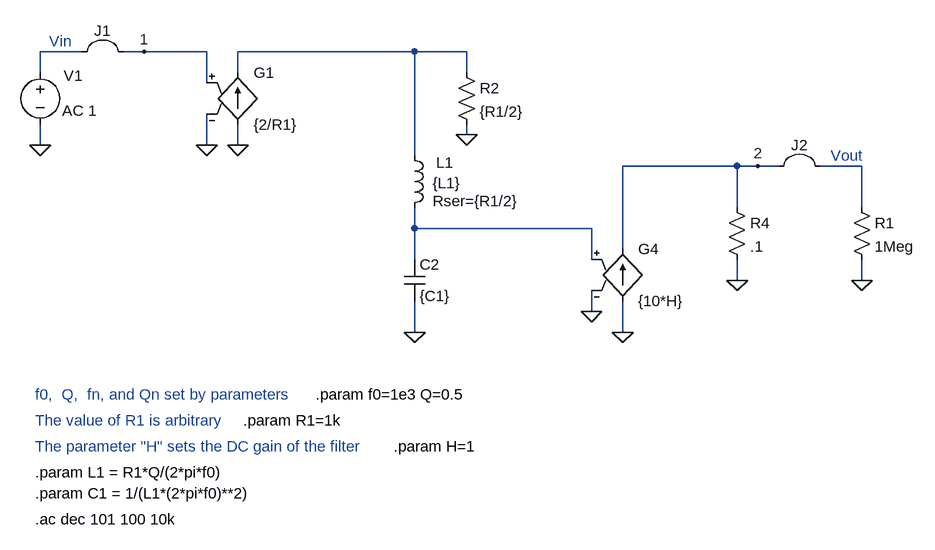
[diagram p0: schematic 2ndOrderLowpass.asc]
2ndOrderLowpass.asc, the LTspice schematic file:
Version 4
SHEET 1 1060 680
WIRE -960 -128 -1024 -128
WIRE -864 -128 -896 -128
WIRE -768 -128 -864 -128
WIRE -448 -128 -720 -128
WIRE -368 -128 -448 -128
WIRE -1024 -96 -1024 -128
WIRE -720 -96 -720 -128
WIRE -368 -96 -368 -128
WIRE -768 -80 -768 -128
WIRE -368 0 -368 -16
WIRE -1024 16 -1024 -16
WIRE -768 16 -768 -32
WIRE -720 16 -720 -16
WIRE -448 32 -448 -128
WIRE 48 48 -128 48
WIRE 80 48 48 48
WIRE 112 48 80 48
WIRE 240 48 176 48
WIRE 48 112 48 48
WIRE 240 112 240 48
WIRE -448 144 -448 112
WIRE -176 144 -448 144
WIRE -128 176 -128 48
WIRE -448 192 -448 144
WIRE -176 192 -176 144
WIRE 48 224 48 192
WIRE 240 224 240 192
WIRE -176 272 -176 240
WIRE -448 304 -448 256
WIRE -128 304 -128 256
FLAG -720 16 0
FLAG -768 16 0
FLAG -368 0 0
FLAG -448 304 0
FLAG 48 224 0
FLAG -128 304 0
FLAG -176 272 0
FLAG -864 -128 1
FLAG 80 48 2
FLAG -1024 16 0
FLAG 240 224 0
SYMBOL g -720 -112 R0
SYMATTR InstName G1
SYMATTR Value {2/R1}
SYMBOL res -384 -112 R0
SYMATTR InstName R2
SYMATTR Value {R1/2}
SYMBOL res 32 96 R0
SYMATTR InstName R4
SYMATTR Value .1
SYMBOL ind -464 16 R0
WINDOW 0 49 27 Left 2
WINDOW 3 44 58 Left 2
WINDOW 123 44 86 Left 2
SYMATTR InstName L1
SYMATTR Value {L1}
SYMATTR Value2 Rser={R1/2}
SYMBOL cap -464 192 R0
SYMATTR InstName C2
SYMATTR Value {C1}
SYMBOL g -128 160 R0
SYMATTR InstName G4
SYMATTR Value {10*H}
SYMBOL Misc\\jumper -928 -192 M0
SYMATTR InstName J1
SYMBOL Misc\\jumper 144 -16 R0
SYMATTR InstName J2
SYMBOL voltage -1024 -112 R0
WINDOW 0 36 21 Left 2
WINDOW 123 34 75 Left 2
WINDOW 39 0 0 Left 0
SYMATTR InstName V1
SYMATTR Value2 AC 1
SYMATTR Value ""
SYMBOL res 224 96 R0
SYMATTR InstName R1
SYMATTR Value 1Meg
TEXT -600 400 Left 2 !.param f0=1e3 Q=0.5
TEXT -1032 400 Left 2 ;f0,  Q,  fn, and Qn set by parameters
TEXT -712 440 Left 2 !.param R1=1k
TEXT -1032 520 Left 2 !.param L1 = R1*Q/(2*pi*f0)
TEXT -1032 552 Left 2 !.param C1 = 1/(L1*(2*pi*f0)**2)
TEXT -976 -144 Right 2 ;Vin
TEXT 192 32 Left 2 ;Vout
TEXT -480 480 Left 2 !.param H=1
TEXT -1032 592 Left 2 !.ac dec 101 100 10k
TEXT -1032 440 Left 2 ;The value of R1 is arbitrary
TEXT -1032 480 Left 2 ;The parameter "H" sets the DC gain of the filter

The netlist it stands for:
* 2ndOrderLowpass.asc
G1 0 N001 1 0 {2/R1}
R2 N001 0 {R1/2}
R4 2 0 .1
L1 N001 N002 {L1} Rser={R1/2}
C2 N002 0 {C1}
G4 0 2 N002 0 {10*H}
V1 1 0 AC 1
R1 2 0 1Meg
.param f0=1e3 Q=0.5
* f0,  Q,  fn, and Qn set by parameters
.param R1=1k
.param L1 = R1*Q/(2*pi*f0)
.param C1 = 1/(L1*(2*pi*f0)**2)
* Vin
* Vout
.param H=1
.ac dec 101 100 10k
* The value of R1 is arbitrary
* The parameter "H" sets the DC gain of the filter
.backanno
.end